# Altium project SmartHome.PrjPCB
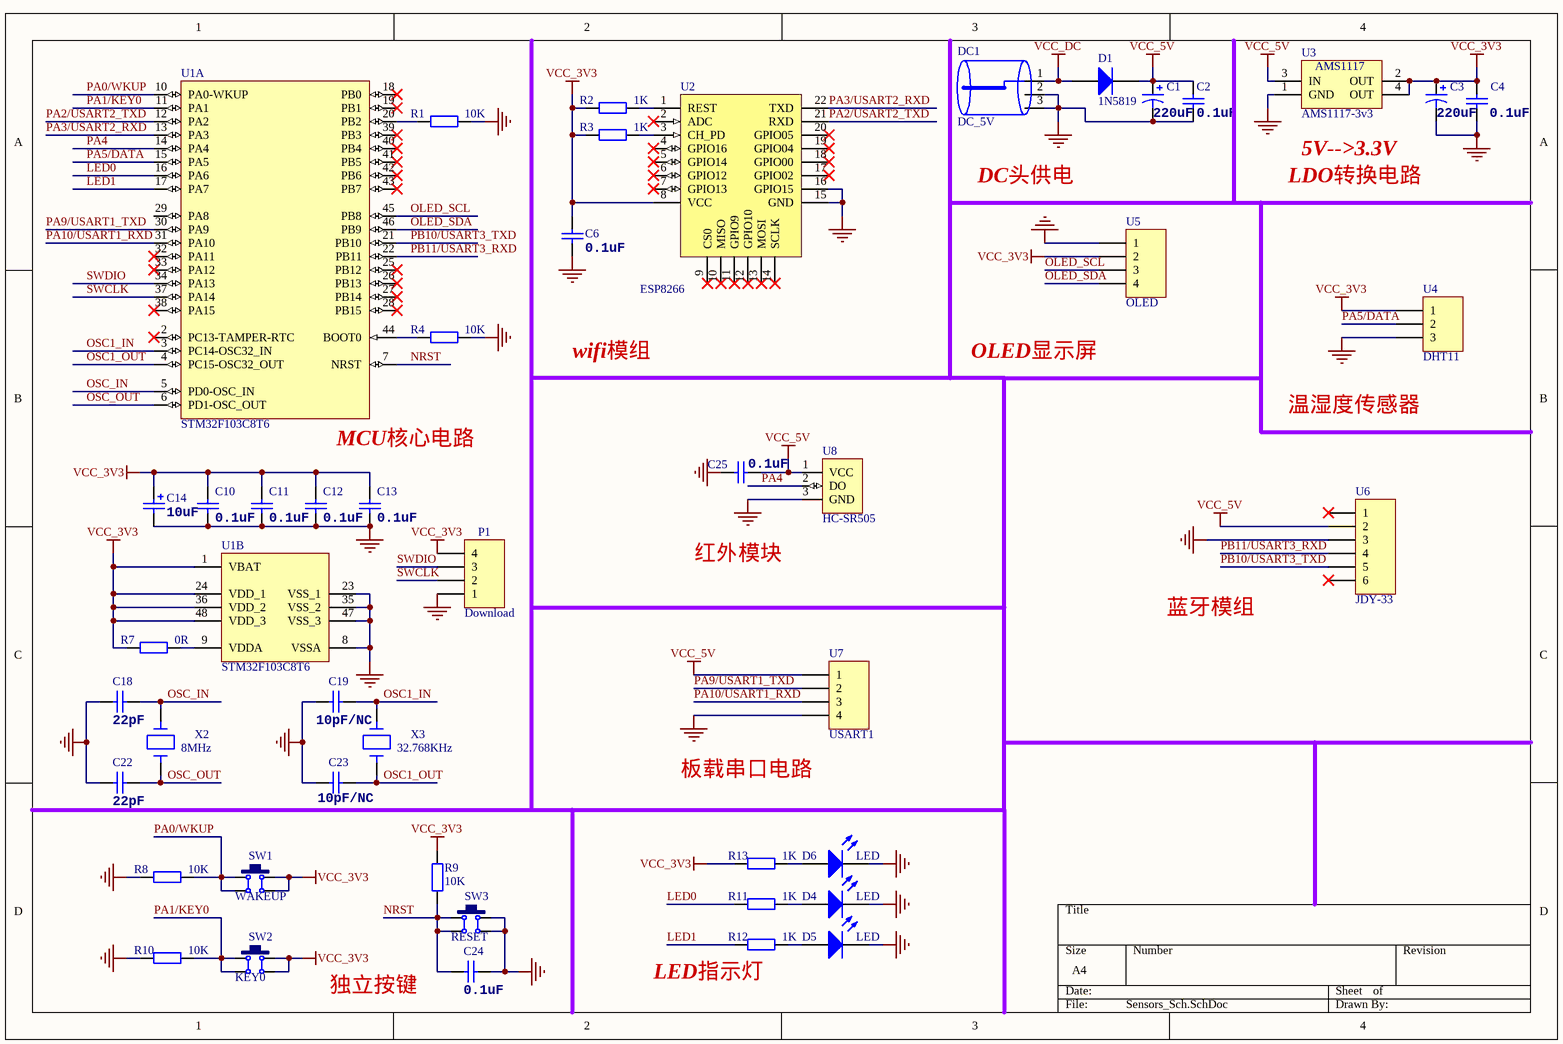
[diagram p0: Sensors_Sch.SchDoc]
1 sheet, 46 parts. Net scope: global (net labels, ports and power ports of the same name join across sheets).
Board file: Sensors_Board_PCB.PcbDoc

## Sheet Sensors_Sch.SchDoc
size A4

### Parts
C1  220uF  [C_SMD(6.3x5.3)]
C2  0.1uF  [C0603]
C3  220uF  [C_SMD(6.3x5.3)]
C4  0.1uF  [C0603]
C6  0.1uF  [C0603]
C10  0.1uF  [C0603]
C11  0.1uF  [C0603]
C12  0.1uF  [C0603]
C13  0.1uF  [C0603]
C14  10uF  [TAC1206]
C18  22pF  [C0603]
C19  10pF/NC  [C0603]
C22  22pF  [C0603]
C23  10pF/NC  [C0603]
C24  0.1uF  [C0603]
C25  0.1uF  [C0603]
D1  1N5819  [SOD123]
D4  LED  [LED_0603]
D5  LED  [LED_0603]
D6  LED  [LED_0603]
DC1  DC_5V  [DC_POWER]
P1  Download  [HDR1X4]
R1  10K  [R0603]
R2  1K  [R0603]
R3  1K  [R0603]
R4  10K  [R0603]
R7  0R  [R0603]
R8  10K  [R0603]
R9  10K  [R0603]
R10  10K  [R0603]
R11  1K  [R0603]
R12  1K  [R0603]
R13  1K  [R0603]
SW1  WAKEUP  [TSW DIP-6*6*6]
SW2  KEY0  [TSW DIP-6*6*6]
SW3  RESET  [TSW DIP-6*6*6]
U1  STM32F103C8T6  [LQFP48 7X7_N]  (parts A,B of 2)
U2  ESP8266  [ESP8266-12E&F]
U3  AMS1117-3v3  [SOT223_L]
U4  DHT11  [DHT11_3P]
U5  OLED  [OLED_0.96_IIC]
U6  JDY-33  [JDY-33]
U7  USART1  [HDR1X4]
U8  HC-SR505  [HC-SR505]
X2  8MHz  [HC-49SMD]
X3  32.768KHz  [Crystal_2x6_DIP]

### Nets
GND: C1.2(-) C2.1 C3.2(-) C4.1 C6.2 C10.1 C11.1 C12.1 C13.1 C14.2(-) C18.2 C19.2 C22.2 C23.2 C24.1 C25.2 D4.2(K) D5.2(K) D6.2(K) DC1.2(GND) DC1.3(GND) P1.1 R1.2 R4.2 R8.1 R10.1 SW3.2 SW3.3 U1.8(VSSA) U1.23(VSS_1) U1.35(VSS_2) U1.47(VSS_3) U2.15(GND) U2.16(GPIO15) U3.1(GND) U4.3 U5.1 U6.3 U7.4 U8.3(GND)
VCC_3V3: C3.1(+) C4.2 C6.1 C10.2 C11.2 C12.2 C13.2 C14.1(+) P1.4 R2.1 R3.1 R7.1 R9.2 R13.1 SW1.2 SW1.3 SW2.2 SW2.3 U1.1(VBAT) U1.24(VDD_1) U1.36(VDD_2) U1.48(VDD_3) U2.8(VCC) U3.2(OUT) U3.4(OUT) U4.1 U5.2
VCC_5V: C1.1(+) C2.2 C25.1 D1.2(K) U3.3(IN) U6.2 U7.1 U8.1(VCC)
VCC_DC: D1.1(A) DC1.1(VCC)
LED0: R11.1 U1.16(PA6)
LED1: R12.1 U1.17(PA7)
NRST: C24.2 R9.1 SW3.1 SW3.4 U1.7(NRST)
OLED_SCL: U1.45(PB8) U5.3
OLED_SDA: U1.46(PB9) U5.4
OSC1_IN: C19.1 U1.3(PC14-OSC32_IN) X3.2(X2)
OSC1_OUT: C23.1 U1.4(PC15-OSC32_OUT) X3.1(X1)
OSC_IN: C18.1 U1.5(PD0-OSC_IN) X2.2(X2)
OSC_OUT: C22.1 U1.6(PD1-OSC_OUT) X2.1(X1)
PA0/WKUP: R8.2 SW1.1 SW1.4 U1.10(PA0-WKUP)
PA1/KEY0: R10.2 SW2.1 SW2.4 U1.11(PA1)
PA2/USART2_TXD: U1.12(PA2) U2.21(RXD)
PA3/USART2_RXD: U1.13(PA3) U2.22(TXD)
PA4: U1.14(PA4) U8.2(DO)
PA5/DATA: U1.15(PA5) U4.2
PA9/USART1_TXD: U1.30(PA9) U7.2
PA10/USART1_RXD: U1.31(PA10) U7.3
PB10/USART3_TXD: U1.21(PB10) U6.5
PB11/USART3_RXD: U1.22(PB11) U6.4
SWCLK: P1.2 U1.37(PA14)
SWDIO: P1.3 U1.34(PA13)
NetD4_1: D4.1(A) R11.2
NetD5_1: D5.1(A) R12.2
NetD6_1: D6.1(A) R13.2
NetR1_1: R1.1 U1.20(PB2)
NetR2_2: R2.2 U2.1(REST)
NetR3_2: R3.2 U2.3(CH_PD)
NetR4_1: R4.1 U1.44(BOOT0)
NetR7_2: R7.2 U1.9(VDDA)

Not connected (* = marked no-connect by the designer): U1 2(PC13-TAMPER-RTC)* 18(PB0)* 19(PB1)* 25(PB12)* 26(PB13)* 27(PB14)* 28(PB15)* 29(PA8) 32(PA11)* 33(PA12)* 38(PA15)* 39(PB3)* 40(PB4)* 41(PB5)* 42(PB6)* 43(PB7)*; U2 2(ADC)* 4(GPIO16)* 5(GPIO14)* 6(GPIO12)* 7(GPIO13)* 9(CS0)* 10(MISO)* 11(GPIO9)* 12(GPIO10)* 13(MOSI)* 14(SCLK)* 17(GPIO02)* 18(GPIO00)* 19(GPIO04)* 20(GPIO05)*; U6 1* 6*

### Notes on the sheet
- DC头供电
- LDO转换电路
- 5V-->3.3V
- wifi模组
- OLED显示屏
- (near U1) MCU核心电路
- 温湿度传感器
- 红外模块
- 蓝牙模组
- 板载串口电路
- 独立按键
- (near R12) LED指示灯
- (in symbol AMS1117-3v3) AMS1117

### Library data of the parts
C1 C3 = Cap3: CAP ALUM POLY 150UF 20% 10V SMD; Manufacturer: KEMET; Manufacturer Part Number: A765EB157M1ALAE022; Type: Polymer; ESR (Equivalent Series Resistance): 22 mOhm; Lifetime @ Temp.: 2000 Hrs @ 105°C; Surface Mount Land Size: 0.260" L x 0.260" W (6.60mm x 6.60mm); Supplier 1: Digi-Key; RoHS: RoHS Compliant; Category: Capacitors; Stock 1: 2690; Pricing 1: 1=0.62, 10=0.44, 100=0.2899, 500=0.2147 (USD); Packaging: Cut Tape (CT); Part Status: Active; Tolerance: ±20%; Operating Temperature: -55°C ~ 105°C; Ratings: -; Applications: General Purpose; Lead Spacing: -; Size / Dimension: 0.248" Dia (6.30mm); Height - Seated (Max): 0.236" (6.00mm); Mounting Type: Surface Mount; Package / Case: Radial, Can - SMD; ComponentLink1URL: https://api.kemet.com/component-edge/download/datasheet/A765EB157M1ALAE022.pdf; ComponentLink1Description: https://api.kemet.com/component-edge/download/datasheet/A765EB157M1ALAE022.pdf; Supplier Part Number 1: 399-13671-1-ND; Value: 220uF
C2 C4 C6 C10-C13 C18 C19 C22-C25 = Cap1: CAP CER 10000PF 100V X7R 0603; Manufacturer: TDK Corporation; Manufacturer Part Number: C1608X7R2A103K080AA; Tolerance: ±10%; Notification: Current market demand for these product types have resulted in fluctuating and extending lead times. Lead times may differ.; Supplier 1: Digi-Key; RoHS: RoHS Compliant; Category: Capacitors; Stock 1: 40000; Pricing 1: 4000=0.01438 (USD); Packaging: Tape & Reel (TR); Part Status: Active; Voltage - Rated: 100V; Temperature Coefficient: X7R; Operating Temperature: -55°C ~ 125°C; Features: -; Ratings: -; Applications: General Purpose; Failure Rate: -; Mounting Type: Surface Mount, MLCC; Package / Case: 0603 (1608 Metric); Size / Dimension: 0.063" L x 0.032" W (1.60mm x 0.80mm); Height - Seated (Max): -; Thickness (Max): 0.035" (0.90mm); Lead Spacing: -; Lead Style: -; ComponentLink1URL: https://product.tdk.com/info/en/catalog/datasheets/mlcc_commercial_midvoltage_en.pdf; ComponentLink1Description: https://product.tdk.com/info/en/catalog/datasheets/mlcc_commercial_midvoltage_en.pdf; Supplier Part Number 1: 445-1304-2-ND
  C2 C4 C6 C10-C13 C24 C25: Value: 0.1uF
  C18 C22: Value: 22pF
  C19 C23: Value: 10pF/NC
C14 = Cap2: CAP TANT 10UF 10V 10% 1206; Manufacturer: KEMET; Manufacturer Part Number: T491A106K010AT7280; Manufacturer Size Code: A; Type: Molded; ESR (Equivalent Series Resistance): 3.8 Ohm; Lifetime @ Temp.: 2000 Hrs @ 125°C; Notification: Current market demand for these product types have resulted in fluctuating and extending lead times. Lead times may differ.; Supplier 1: Digi-Key; RoHS: RoHS Compliant; Category: Capacitors; Stock 1: 27000; Pricing 1: 9000=0.084, 18000=0.08138, 27000=0.07875, 63000=0.0735 (USD); Packaging: Tape & Reel (TR); Part Status: Active; Tolerance: ±10%; Operating Temperature: -55°C ~ 125°C; Mounting Type: Surface Mount; Package / Case: 1206 (3216 Metric); Size / Dimension: 0.126" L x 0.063" W (3.20mm x 1.60mm); Height - Seated (Max): 0.071" (1.80mm); Lead Spacing: -; Features: General Purpose; Failure Rate: -; ComponentLink1URL: https://api.kemet.com/component-edge/download/datasheet/T491A106K010AT7280.pdf; ComponentLink1Description: https://api.kemet.com/component-edge/download/datasheet/T491A106K010AT7280.pdf; Supplier Part Number 1: 399-8268-2-ND; Value: 10uF
D1 = Diode: Default Diode; Published: 8-Jun-2000; LatestRevisionDate: 17-Jul-2002; LatestRevisionNote: Re-released for DXP Platform.; PackageVersion: Sep-1996; PackageReference: SMC; Publisher: Altium Limited; PackageDescription: DO-214-AB/SMC; 2 C-Bend Leads; Body 7.9 x 5.9 mm, inc. leads (LxW); Code_JEDEC: DO-214-AB
D4-D6 = LED: Typical RED GaAs LED; Published: 8-Jun-2000; LatestRevisionDate: 08-Jul-2005; LatestRevisionNote: Mech Layer 1 removed.; PackageReference: LED-1; Publisher: Altium Limited; PackageDescription: LED; 2 Leads
DC1 = DC_5V: DC005; Manufacturer: TruConnect; Manufacturer Part Number: K-DC-0052.5; Mount: Socket
P1 U5 U7 = Header 4: Header, 4-Pin; LatestRevisionDate: 17-Jul-2002; LatestRevisionNote: Re-released for DXP Platform.; Publisher: Altium Limited
R1-R4 R7-R13 = R: 贴片电阻; 版权归属: 源创客; BOM名称: 贴片电阻; 学习资源: www.ooocke.com
  R1 R4 R8-R10: Value: 10K
  R2 R3 R11-R13: Value: 1K
  R7: Value: 0R
SW1-SW3 = TSW DIP-6x6: 直插6x6轻触开关; 版权归属: 源创客; BOM名称: 直插6x6轻触开关; 学习资源: www.ooocke.com
U1 = STM32F103C8T6: ARM Cortex-M3 32-bit MCU, 64 KB Flash, 20 KB Internal RAM, 37 I/Os, 48-pin LQFP, -40 to 85 degC, Tray; A/D Converter: 2x12-bit (10 Channel); FLASH Size (Prog) (kB): 64; I/Os (High Current): 37; Internal RAM Size (kB): 20; Operating Frequency(F) (Processor speed) (MHz): 72; Supply Voltage(Vcc) min (V): 2; DatasheetVersion: Rev. 16; PackageVersion: Rev. 6, 06/2013; PackageReference: LQFP48; PackageDescription: 48-Pin Low Profile Quad Flat Package, 7 x 7 mm Body, 0.5 mm Pitch; Supplier 1: Digi-Key; Supplier Part Number 1: 497-6063-ND; Supplier 2: Farnell; Supplier Part Number 2: 1447637; Supplier 3: Newark; Supplier Part Number 3: 59M2182; Supplier 4: Newark; Supplier Part Number 4: 57P1222; Supplier 5: Mouser; Supplier Part Number 5: 511-STM32F103C8T6; Core: ARM Cortex-M3; Packing: Tray; Mounting Technology: Surface Mount; PartNumber: STM32F103C8T6; ComponentLink1Description: Manufacturer URL; ComponentLink1URL: http://www.st.com/web/en/home.html; ComponentLink2Description: Datasheet; ComponentLink2URL: http://www.st.com/st-web-ui/static/active/en/resource/technical/document/datasheet/CD00161566.pdf; ComponentLink3Description: Package Specification; ComponentLink3URL: http://www.st.com/st-web-ui/static/active/en/resource/technical/document/datasheet/DM00058181.pdf
U2 = ESP8266串口WIFI: ESP8266串口WIFI ESP-12F 无线透传 WIFI模块
U4 = Header 3: Header, 3-Pin; LatestRevisionDate: 17-Jul-2002; LatestRevisionNote: Re-released for DXP Platform.; Publisher: Altium Limited
U6 = Header 6: Header, 6-Pin; LatestRevisionDate: 17-Jul-2002; LatestRevisionNote: Re-released for DXP Platform.; Publisher: Altium Limited
U8 = HC-SR501
X2 X3 = Crystal: CRYSTAL 12.0000MHZ 18PF SMD; Manufacturer: Abracon LLC; Manufacturer Part Number: ABLS-12.000MHZ-B2-T; Frequency Stability: ±50ppm; Frequency Tolerance: ±20ppm; Operating Mode: Fundamental; Supplier 1: Digi-Key; RoHS: RoHS Compliant; Category: Crystals, Oscillators, Resonators; Stock 1: 85000; Pricing 1: 1000=0.136, 3000=0.1275, 5000=0.12325, 10000=0.119 (USD); Packaging: Tape & Reel (TR); Part Status: Active; Type: MHz Crystal; Load Capacitance: 18pF; Operating Temperature: -20°C ~ 70°C; Ratings: -; Mounting Type: Surface Mount; Package / Case: HC-49/US; Size / Dimension: 0.449" L x 0.185" W (11.40mm x 4.70mm); Height - Seated (Max): 0.165" (4.20mm); ComponentLink1URL: https://abracon.com/Resonators/abls.pdf; ComponentLink1Description: https://abracon.com/Resonators/abls.pdf; Supplier Part Number 1: 535-9067-2-ND
  X2: Value: 8MHz
  X3: Value: 32.768KHz